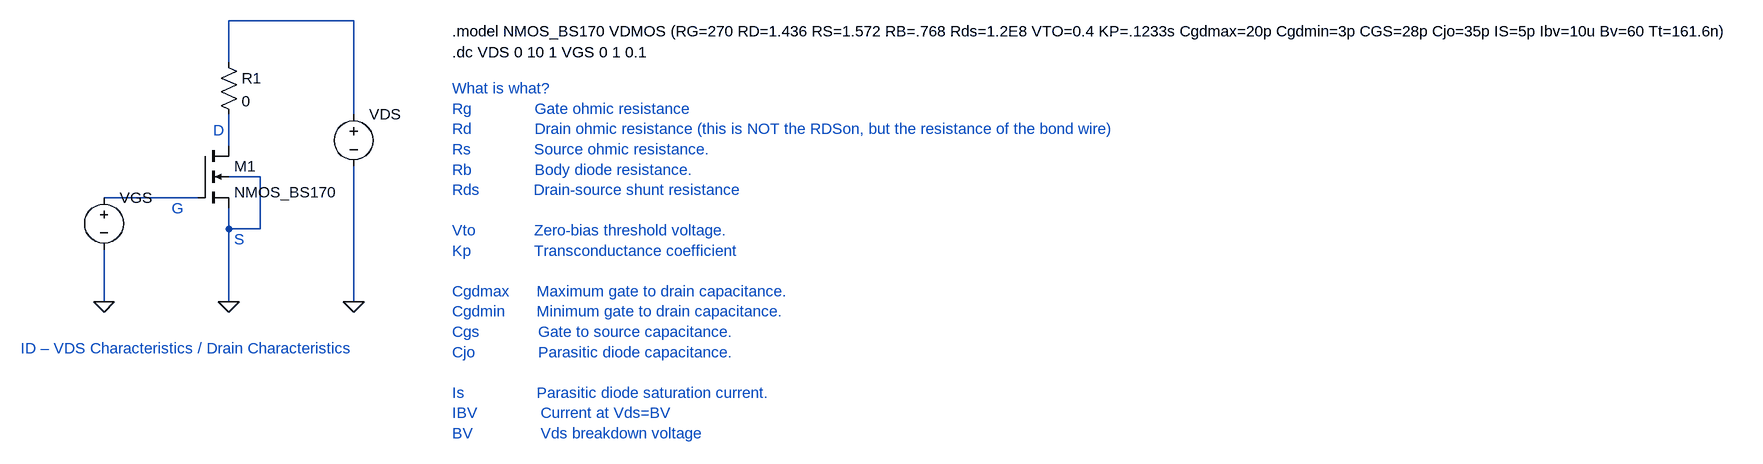
[diagram p0: schematic Draft1.asc]
Draft1.asc, the LTspice schematic file:
Version 4
SHEET 1 2216 920
WIRE -64 -112 -256 -112
WIRE -256 -48 -256 -112
WIRE -64 32 -64 -112
WIRE -256 80 -256 32
WIRE -208 128 -256 128
WIRE -304 160 -448 160
WIRE -256 208 -256 176
WIRE -208 208 -208 128
WIRE -208 208 -256 208
WIRE -448 320 -448 240
WIRE -256 320 -256 208
WIRE -64 320 -64 112
FLAG -256 320 0
FLAG -448 320 0
FLAG -64 320 0
SYMBOL nmos4 -304 80 R0
SYMATTR InstName M1
SYMATTR Value NMOS_BS170
SYMATTR Value2 l=1 w=10u
SYMBOL voltage -448 144 R0
SYMATTR InstName VGS
SYMATTR Value ""
SYMBOL voltage -64 16 R0
WINDOW 3 24 44 Left 2
WINDOW 123 0 0 Left 0
WINDOW 39 0 0 Left 0
SYMATTR Value ""
SYMATTR InstName VDS
SYMBOL res -272 -64 R0
SYMATTR InstName R1
SYMATTR Value 0
TEXT 88 -96 Left 2 !.model NMOS_BS170 VDMOS (RG=270 RD=1.436 RS=1.572 RB=.768 Rds=1.2E8 VTO=0.4 KP=.1233s Cgdmax=20p Cgdmin=3p CGS=28p Cjo=35p IS=5p Ibv=10u Bv=60 Tt=161.6n)
TEXT 88 -64 Left 2 !.dc VDS 0 10 1 VGS 0 1 0.1
TEXT 88 -8 Left 2 ;What is what?\nRg              Gate ohmic resistance\nRd              Drain ohmic resistance (this is NOT the RDSon, but the resistance of the bond wire)\nRs              Source ohmic resistance.\nRb              Body diode resistance.          \nRds            Drain-source shunt resistance\n \nVto             Zero-bias threshold voltage.\nKp              Transconductance coefficient\n \nCgdmax      Maximum gate to drain capacitance.\nCgdmin       Minimum gate to drain capacitance.\nCgs             Gate to source capacitance.\nCjo              Parasitic diode capacitance.\n \nIs                Parasitic diode saturation current.\nIBV              Current at Vds=BV\nBV               Vds breakdown voltage
TEXT -576 392 Left 2 ;ID – VDS Characteristics / Drain Characteristics
TEXT -280 56 Left 2 ;D
TEXT -344 176 Left 2 ;G
TEXT -248 224 Left 2 ;S

The netlist it stands for:
* Draft1.asc
M1 N002 N003 0 0 NMOS_BS170 l=1 w=10u
VGS N003 0
VDS N001 0
R1 N001 N002 0
.model NMOS NMOS
.model PMOS PMOS
.lib standard.mos
.model NMOS_BS170 VDMOS (RG=270 RD=1.436 RS=1.572 RB=.768 Rds=1.2E8 VTO=0.4 KP=.1233s Cgdmax=20p Cgdmin=3p CGS=28p Cjo=35p IS=5p Ibv=10u Bv=60 Tt=161.6n)
.dc VDS 0 10 1 VGS 0 1 0.1
* What is what?
* Rg              Gate ohmic resistance
* Rd              Drain ohmic resistance (this is NOT the RDSon, but the resistance of the bond wire)
* Rs              Source ohmic resistance.
* Rb              Body diode resistance.
* Rds            Drain-source shunt resistance
* Vto             Zero-bias threshold voltage.
* Kp              Transconductance coefficient
* Cgdmax      Maximum gate to drain capacitance.
* Cgdmin       Minimum gate to drain capacitance.
* Cgs             Gate to source capacitance.
* Cjo              Parasitic diode capacitance.
* Is                Parasitic diode saturation current.
* IBV              Current at Vds=BV
* BV               Vds breakdown voltage
* ID – VDS Characteristics / Drain Characteristics
* D
* G
* S
.backanno
.end